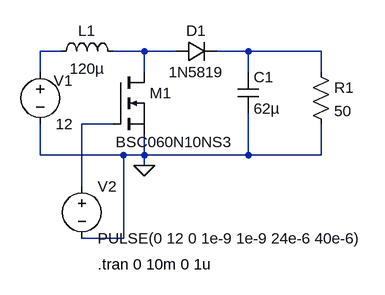
[diagram p0: schematic Boost_Converter.asc]
Boost_Converter.asc, the LTspice schematic file:
Version 4.1
SHEET 1 880 680
WIRE 64 80 32 80
WIRE 192 80 144 80
WIRE 240 80 192 80
WIRE 352 80 304 80
WIRE 464 80 352 80
WIRE 32 112 32 80
WIRE 192 112 192 80
WIRE 352 112 352 80
WIRE 464 112 464 80
WIRE 144 192 96 192
WIRE 32 240 32 192
WIRE 160 240 32 240
WIRE 192 240 192 208
WIRE 192 240 160 240
WIRE 352 240 352 176
WIRE 352 240 192 240
WIRE 464 240 464 192
WIRE 464 240 352 240
WIRE 192 256 192 240
WIRE 96 288 96 192
WIRE 160 368 160 240
WIRE 160 368 96 368
FLAG 192 256 0
SYMBOL voltage 32 96 R0
WINDOW 0 21 29 Left 2
SYMATTR InstName V1
SYMATTR Value 12
SYMBOL nmos 144 112 R0
WINDOW 3 4 108 Left 2
SYMATTR InstName M1
SYMATTR Value BSC060N10NS3
SYMBOL ind 48 96 R270
WINDOW 0 32 56 VTop 2
WINDOW 3 5 56 VBottom 2
SYMATTR InstName L1
SYMATTR Value 120µ
SYMBOL diode 240 96 R270
WINDOW 0 32 32 VTop 2
WINDOW 3 0 32 VBottom 2
SYMATTR InstName D1
SYMATTR Value 1N5819
SYMBOL cap 336 112 R0
SYMATTR InstName C1
SYMATTR Value 62µ
SYMBOL res 448 96 R0
SYMATTR InstName R1
SYMATTR Value 50
SYMBOL voltage 96 272 R0
WINDOW 123 0 0 Left 0
WINDOW 39 0 0 Left 0
SYMATTR InstName V2
SYMATTR Value PULSE(0 12 0 1e-9 1e-9 24e-6 40e-6)
TEXT 120 408 Left 2 !.tran 0 10m 0 1u

The netlist it stands for:
* Boost_Converter.asc
V1 N001 0 12
M1 N002 N004 0 0 BSC060N10NS3
L1 N001 N002 120µ
D1 N002 N003 1N5819
C1 N003 0 62µ
R1 N003 0 50
V2 N004 0 PULSE(0 12 0 1e-9 1e-9 24e-6 40e-6)
.model D D
.lib standard.dio
.model NMOS NMOS
.model PMOS PMOS
.lib standard.mos
.tran 0 10m 0 1u
.backanno
.end